# Altium schematic sheet [4]_RFM95W.SchDoc
size A4
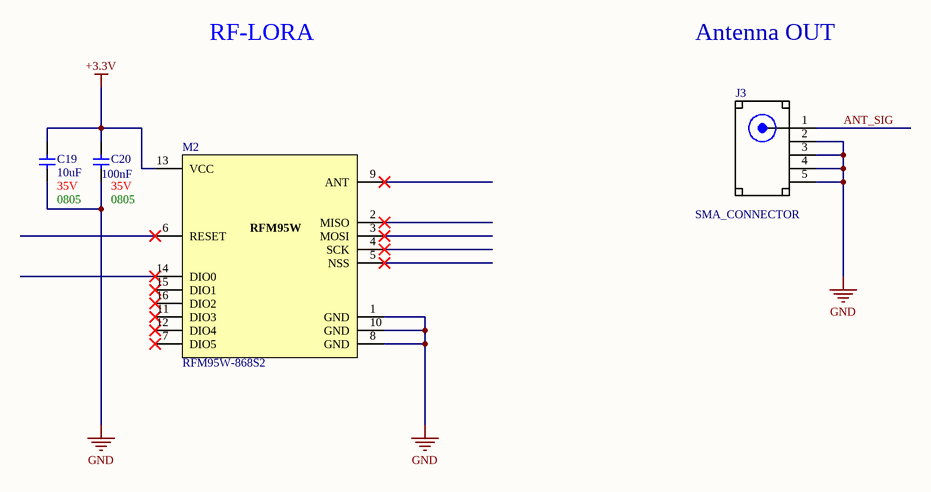
[diagram p0: [4]_RFM95W.SchDoc]

## Parts
C19  value 10uF  Voltage: 35V  Package: 0805  [Capacitor_0805]  (hidden comment: Capacitor SMD 0805)
C20  value 100nF  Voltage: 35V  Package: 0805  [Capacitor_0805]  (hidden comment: Capacitor SMD 0805)
J3  SMA_CONNECTOR  [LPRS_SMA_CONNECTOR]
M2  RFM95W-868S2  [RFM95W-868S2]

## Nets
+3.3V: C19.2 C20.2 M2.13(VCC)
GND: C19.1 C20.1 J3.2(GND) J3.3(GND) J3.4(GND) J3.5(GND) M2.1(GND) M2.8(GND) M2.10(GND)
ANT_SIG: J3.1(ANT)

Not connected (* = marked no-connect by the designer): M2 2(MISO)* 3(MOSI)* 4(SCK)* 5(NSS)* 6(RESET)* 7(DIO5)* 9(ANT)* 11(DIO3)* 12(DIO4)* 14(DIO0)* 15(DIO1)* 16(DIO2)*

## Notes on the sheet
- Labels drawn without touching a wire or pin: Antenna OUT, RF-LORA

## Library data of the parts
C19 C20 = Capacitor SMD 0805: Ceramic Capacitor SMD 0805; Tolerance: 10%
J3 = SMA_CONNECTOR: CONNECTOR, SMA, ANTENNA; SVHC: No SVHC _19-Dec-2012_; For Use With: Antenna; Kit Contents: SMA Connector; MF: LPRS; SnapEDA_Link: https://www.snapeda.com/parts/SMA%20CONNECTOR/LPRS/view-part/?ref=snap; Availability: Good; MP: SMA CONNECTOR; Package: None; Price: 1.03 USD; Value: *
M2 = RFM95W: HOPE MICROELECTRONICS RFM95W-868S2 - LoRa RF Module; Rule: PcbType=ProtelPcb